# EAGLE design NPKC_alt_PCB (EAGLE 7.4.0)

## Sheet 1 of 2: Switch matrix
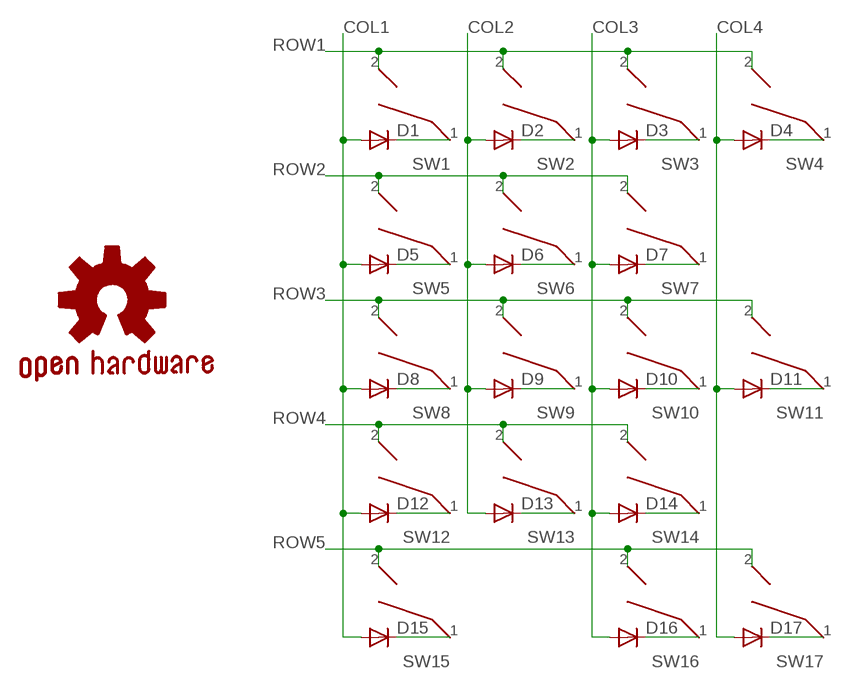
[diagram p0: schematic, sheet 1]

### Parts
D1  CGRM4001-G  [SOD-123_MINI-SMA]
D2  CGRM4001-G  [SOD-123_MINI-SMA]
D3  CGRM4001-G  [SOD-123_MINI-SMA]
D4  CGRM4001-G  [SOD-123_MINI-SMA]
D5  CGRM4001-G  [SOD-123_MINI-SMA]
D6  CGRM4001-G  [SOD-123_MINI-SMA]
D7  CGRM4001-G  [SOD-123_MINI-SMA]
D8  CGRM4001-G  [SOD-123_MINI-SMA]
D9  CGRM4001-G  [SOD-123_MINI-SMA]
D10  CGRM4001-G  [SOD-123_MINI-SMA]
D11  CGRM4001-G  [SOD-123_MINI-SMA]
D12  CGRM4001-G  [SOD-123_MINI-SMA]
D13  CGRM4001-G  [SOD-123_MINI-SMA]
D14  CGRM4001-G  [SOD-123_MINI-SMA]
D15  CGRM4001-G  [SOD-123_MINI-SMA]
D16  CGRM4001-G  [SOD-123_MINI-SMA]
D17  CGRM4001-G  [SOD-123_MINI-SMA]
GOLD_ORB_SM1  OSHWLOGO_GOLD_ORB_SM  [OSHW2]
SW1  Num_Lock  CHERRY_MX_WITH_FIXING_PINS  [MX1A-XXNW]
SW2  NP_/  CHERRY_MX_WITH_FIXING_PINS  [MX1A-XXNW]
SW3  NP_*  CHERRY_MX_WITH_FIXING_PINS  [MX1A-XXNW]
SW4  NP_-  CHERRY_MX_WITH_FIXING_PINS  [MX1A-XXNW]
SW5  NP_7  CHERRY_MX_WITH_FIXING_PINS  [MX1A-XXNW]
SW6  NP_8  CHERRY_MX_WITH_FIXING_PINS  [MX1A-XXNW]
SW7  NP_9  CHERRY_MX_WITH_FIXING_PINS  [MX1A-XXNW]
SW8  NP_4  CHERRY_MX_WITH_FIXING_PINS  [MX1A-XXNW]
SW9  NP_5  CHERRY_MX_WITH_FIXING_PINS  [MX1A-XXNW]
SW10  NP_6  CHERRY_MX_WITH_FIXING_PINS  [MX1A-XXNW]
SW11  NP_+  CHERRY_MX_WITH_FIXING_PINS  [MX1A-XXNW]
SW12  NP_1  CHERRY_MX_WITH_FIXING_PINS  [MX1A-XXNW]
SW13  NP_2  CHERRY_MX_WITH_FIXING_PINS  [MX1A-XXNW]
SW14  NP_3  CHERRY_MX_WITH_FIXING_PINS  [MX1A-XXNW]
SW15  NP_0  CHERRY_MX_WITH_FIXING_PINS  [MX1A-XXNW]
SW16  NP_.  CHERRY_MX_WITH_FIXING_PINS  [MX1A-XXNW]
SW17  NP_Enter  CHERRY_MX_WITH_FIXING_PINS  [MX1A-XXNW]

### Nets
COL1: D1.A D5.A D8.A D12.A D15.A ; also sheet 2
COL2: D2.A D6.A D9.A D13.A ; also sheet 2
COL3: D3.A D7.A D10.A D14.A D16.A ; also sheet 2
COL4: D4.A D11.A D17.A ; also sheet 2
N$1: D1.C SW1.1
N$2: D2.C SW2.1
N$3: D3.C SW3.1
N$4: D4.C SW4.1
N$5: D5.C SW5.1
N$6: D6.C SW6.1
N$7: D7.C SW7.1
N$8: D8.C SW8.1
N$9: D9.C SW9.1
N$10: D10.C SW10.1
N$11: D11.C SW11.1
N$12: D12.C SW12.1
N$13: D13.C SW13.1
N$14: D14.C SW14.1
N$15: D15.C SW15.1
N$16: D16.C SW16.1
N$17: D17.C SW17.1
ROW1: SW1.2 SW2.2 SW3.2 SW4.2 ; also sheet 2
ROW2: SW5.2 SW6.2 SW7.2 ; also sheet 2
ROW3: SW8.2 SW9.2 SW10.2 SW11.2 ; also sheet 2
ROW4: SW12.2 SW13.2 SW14.2 ; also sheet 2
ROW5: SW15.2 SW16.2 SW17.2 ; also sheet 2

## Sheet 2 of 2: Microcontroller
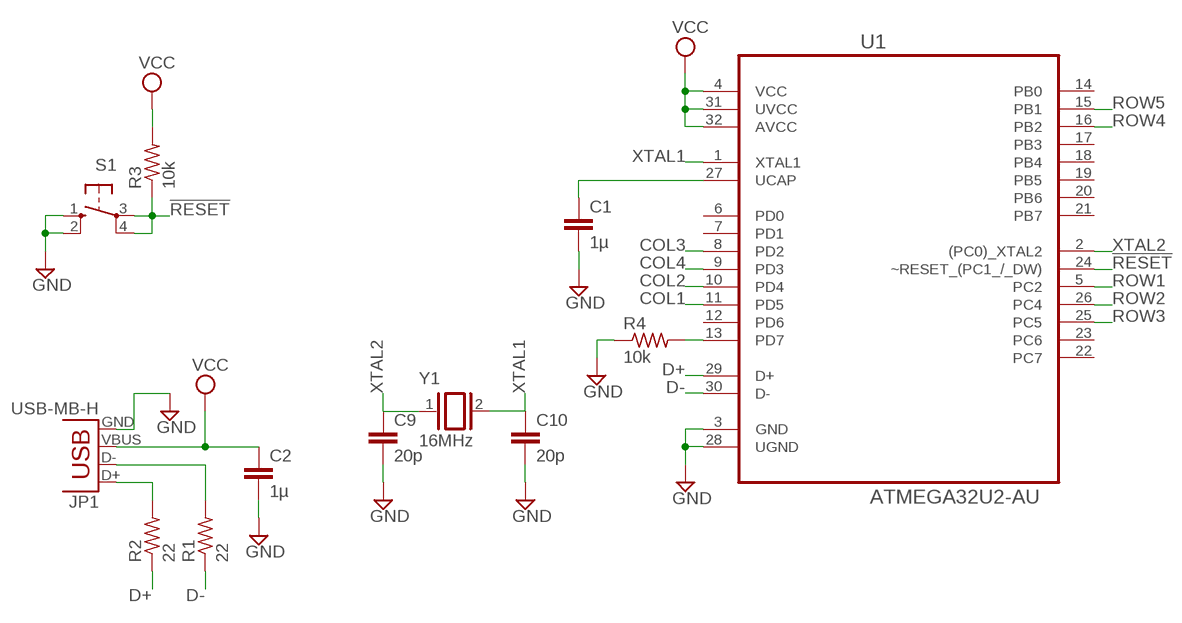
[diagram p1: schematic, sheet 2]

### Parts
C1  1µ  C-EUC0805K  [C0805K]
C2  1µ  C-EUC0805  [C0805]
C9  20p  C-EUC0805K  [C0805K]
C10  20p  C-EUC0805K  [C0805K]
JP1  USB-MB-H  [USB-MB-H]
R1  22  R-US_R0805  [R0805]
R2  22  R-US_R0805  [R0805]
R3  10k  R-US_R0805  [R0805]
R4  10k  R-US_R0805  [R0805]
S1  10-XX  [B3F-10XX]
U1  ATMEGA32U2-AU  [QFP80P900X900X120-32N]
Y1  16MHz  XTAL/S  [QS]

### Nets
!RESET!: R3.1 S1.3(P) S1.4(P1) U1.24(~RESET_(PC1_/_DW))
COL1: U1.11(PD5) ; also sheet 1
COL2: U1.10(PD4) ; also sheet 1
COL3: U1.8(PD2) ; also sheet 1
COL4: U1.9(PD3) ; also sheet 1
D+: R2.1 U1.29(D+)
D-: R1.1 U1.30(D-)
GND: C1.2 C2.2 C9.2 C10.2 JP1.GND R4.1 S1.1(S) S1.2(S1) U1.3(GND) U1.28(UGND)
N$18: C1.1 U1.27(UCAP)
N$19: R4.2 U1.13(PD7)
N$20: JP1.D+ R2.2
N$21: JP1.D- R1.2
ROW1: U1.5(PC2) ; also sheet 1
ROW2: U1.26(PC4) ; also sheet 1
ROW3: U1.25(PC5) ; also sheet 1
ROW4: U1.16(PB2) ; also sheet 1
ROW5: U1.15(PB1) ; also sheet 1
VCC: C2.1 JP1.VBUS R3.2 U1.4(VCC) U1.31(UVCC) U1.32(AVCC)
XTAL1: C10.1 U1.1(XTAL1) Y1.2
XTAL2: C9.1 U1.2((PC0)_XTAL2) Y1.1
Unconnected: U1.6(PD0) U1.7(PD1) U1.12(PD6) U1.14(PB0) U1.17(PB3) U1.18(PB4) U1.19(PB5) U1.20(PB6) U1.21(PB7) U1.22(PC7) U1.23(PC6)

## Library data of the parts
C1 C2 C9 C10 = resistor:C-EU: CAPACITOR, European symbol
D1-D17 = diode:CGRM400*-G: Molded plasitc,JEDEC SOD-123/Mini SMA Source: Comchip CGRM4001-G.pdf
GOLD_ORB_SM1 = OpenHardware:OSHWLOGO: These are Open-Source Hardware logos.
JP1 = SparkFun-Connectors:USB: USB Connectors USB-B-PTH is fully proven SKU : PRT-00139/CONN-08278 USB-miniB is fully proven SKU : PRT-00587 USB-A-PCB is untested. USB-A-H is throughly reviewed, but untested. Spark Fun Electronics SKU : PRT-00437 USB-B-SMT is throughly reviewed, but untested. Needs silkscreen touching up. USB-A-S has not been used/tested USB-MB-H has not been used/tested USB-MICROB has been used. CONN-09505
R1-R4 = resistor:R-US_: RESISTOR, American symbol
S1 = switch-omron:10-XX: OMRON SWITCH; MPN: B3F-1000; OC_FARNELL: 176432; OC_NEWARK: 36M3542
SW1-SW17 = Cherry_MX_v7.0:CHERRY_MX
U1 = ATMEGA32U2:ATMEGA32U2-AU: 8-bit Microcontroller with ISP Flash and USB Controller; MPN: ATMEGA32U2-AU; OC_FARNELL: 1748524; OC_NEWARK: 68T2834; PACKAGE: TQFP-32; SUPPLIER: Atmel
Y1 = special:XTAL/S: CRYSTAL

## Board
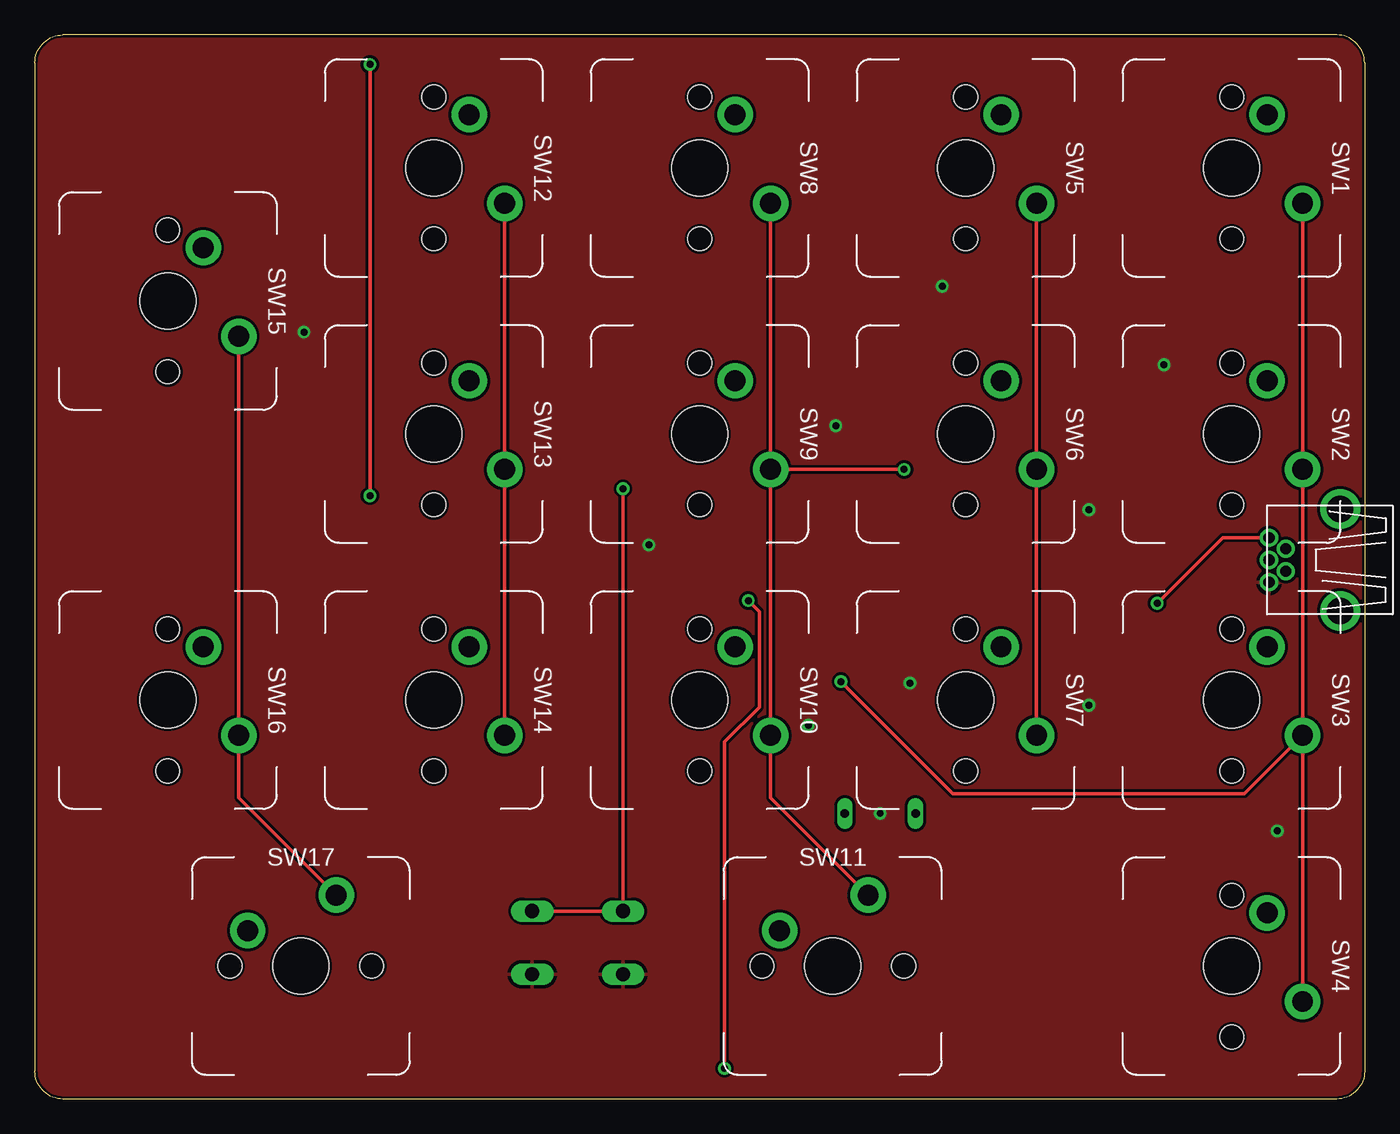
[diagram p2: board, top side]
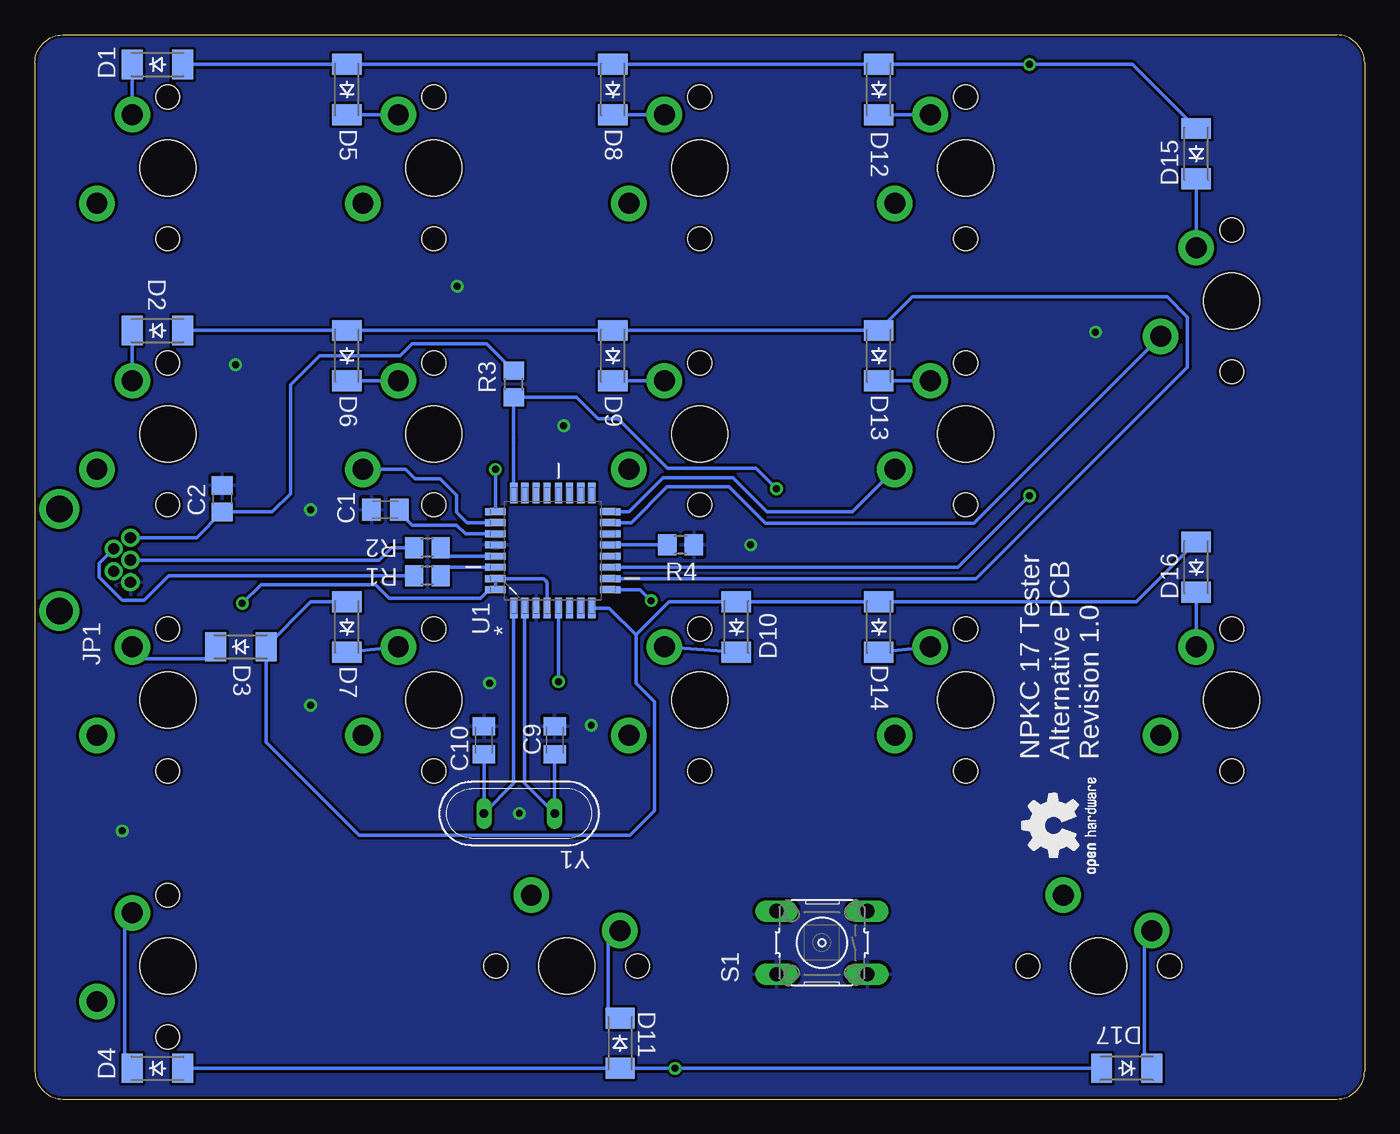
[diagram p3: board, bottom side, seen from below]

Size 95.25 x 76.2 mm. Coordinates in mm from the lower left corner, seen from the top.
Outline: 0,74.2 0,2 arc90 2,0 93.25,0 arc90 95.25,2 95.25,74.2 arc90 93.25,76.2 2,76.2 arc90 0,74.2
Copper layers (1*16): Top 0.035mm / dielectric 1.5mm / Bottom 0.035mm
Design rules "default *": minimum track width 10mil, minimum drill 24mil, track to track 8mil, track to pad 8mil, pad to pad 8mil, via to via 8mil, smd to smd 8mil, copper to edge 8mil, drill to drill 8mil, minimum pad ring 10mil, minimum via ring 8mil, stop-mask expansion 4mil, vias tented up to drill 0mil, thermal gap 10mil

### Footprints (pad centres in the part's own frame; a part is rotated, then mirrored left to right if it is on the bottom)
C0805K = smd 1.3 x 1.6: 1 -1,0; 2 1,0
C0805 = smd 1.3 x 1.5: 1 -0.95,0; 2 0.95,0
SOD-123_MINI-SMA = smd 1.5 x 2.1: A 1.8,0; C -1.8,0
USB-MB-H = drill 0.8: D+ 5.1,0; D- 3.9,0.8; GND 5.1,-1.6; ID 3.9,-0.8; VBUS 5.1,1.6 | drill 1.9: P$6 0,-3.65; P$7 0,3.65
R0805 = smd 1.3 x 1.5: 1 -0.95,0; 2 0.95,0
B3F-10XX = drill 1.016 long: 1 -3.251,2.261; 2 3.251,2.261; 3 -3.251,-2.261; 4 3.251,-2.261
MX1A-XXNW = drill 1.5 pad 2.54: 1 -3.81,2.54; 2 2.54,5.08 | hole 4: 0,0 | hole 1.7: -5.08,0; 5.08,0
QFP80P900X900X120-32N = smd 1.473 x 0.508: 1 -4.115,2.794; 2 -4.115,2.007; 3 -4.115,1.194; 4 -4.115,0.406; 5 -4.115,-0.406; 6 -4.115,-1.194; 7 -4.115,-2.007; 8 -4.115,-2.794; 17 4.115,-2.794; 18 4.115,-2.007; 19 4.115,-1.194; 20 4.115,-0.406; 21 4.115,0.406; 22 4.115,1.194; 23 4.115,2.007; 24 4.115,2.794 | smd 0.508 x 1.473: 9 -2.794,-4.115; 10 -2.007,-4.115; 11 -1.194,-4.115; 12 -0.406,-4.115; 13 0.406,-4.115; 14 1.194,-4.115; 15 2.007,-4.115; 16 2.794,-4.115; 25 2.794,4.115; 26 2.007,4.115; 27 1.194,4.115; 28 0.406,4.115; 29 -0.406,4.115; 30 -1.194,4.115; 31 -2.007,4.115; 32 -2.794,4.115
QS = drill 0.61 long: 1 -2.54,0; 2 2.54,0

### Placement (x,y rotation side)
C1  70.14,42.2 180 bottom
C2  81.82,42.99 90 bottom
C9  58.01,25.7 90 bottom
C10  63.09,25.7 90 bottom
D1  86.47,74.08 0 bottom
D2  86.47,55.03 0 bottom
D3  80.5,32.38 0 bottom
D4  86.47,2.2 0 bottom
D5  72.9,72.28 90 bottom
D6  72.9,53.23 90 bottom
D7  72.9,33.8 90 bottom
D8  53.85,72.28 90 bottom
D9  53.85,53.23 90 bottom
D10  45,33.8 90 bottom
D11  53.34,4 270 bottom
D12  34.8,72.28 90 bottom
D13  34.8,53.23 90 bottom
D14  34.8,33.8 90 bottom
D15  12.06,67.7 90 bottom
D16  12.06,38.09 90 bottom
D17  17.04,2.2 180 bottom
GOLD_ORB_SM1  18,15.77 90 bottom
JP1  93.5,38.6 0 bottom
R1  67.14,37.47 180 bottom
R2  67.14,39.48 180 bottom
R3  60.95,51.2 90 bottom
R4  49,39.68 180 bottom
S1  38.88,11.2 180 bottom
SW1  85.72,66.67 270 top
SW2  85.72,47.62 270 top
SW3  85.72,28.57 270 top
SW4  85.72,9.53 270 top
SW5  66.67,66.67 270 top
SW6  66.67,47.62 270 top
SW7  66.67,28.57 270 top
SW8  47.62,66.67 270 top
SW9  47.62,47.62 270 top
SW10  47.62,28.57 270 top
SW11  57.15,9.53 0 top
SW12  28.57,66.67 270 top
SW13  28.57,47.62 270 top
SW14  28.57,28.57 270 top
SW15  9.53,57.15 270 top
SW16  9.53,28.57 270 top
SW17  19.05,9.53 0 top
U1  58.15,39.27 90 bottom
Y1  60.55,20.45 180 bottom

### Tracks (layer width: path | path; a pad name or v marks a point on that pad's centre or on a via)
!RESET!  (via drill 0.5)
  Top 0.254: S1.3 S1.4 v42.13,43.7
  Bottom 0.254: U1.24 60.94,47.2 R3.1 56.45,50.25 54.9,48.7 53.47,48.7 49.92,45.16 43.59,45.16 v42.13,43.7
COL1  (via drill 0.5)
  Top 0.254: v24,43.2 v24,74.08
  Bottom 0.254: D15.A 16.65,74.08 v24,74.08 D12.A D8.A D5.A D1.A | v24,43.2 29.12,38.08 U1.11
COL2
  Bottom 0.254: D2.A D6.A D9.A D13.A 32.38,57.45 14.14,57.45 12.7,56 12.7,52.41 27.84,37.27 U1.10
COL3
  Bottom 0.254: D7.A 75.48,35.6 D3.A 78.7,25.56 72.04,18.9 52.62,18.9 50.85,20.66 50.85,28.43 52.2,29.79 52.2,33.23 | D16.A 16.36,35.6 D14.A D10.A 49.84,35.6 52.2,33.23 | 52.2,33.23 54.13,35.16 U1.8
COL4  (via drill 0.5)
  Top 0.254: v49.4,2.2 49.4,25.57 51.9,28.07 51.9,34.9 v51.1,35.69
  Bottom 0.254: v51.1,35.69 51.9,36.48 U1.9 | D4.A D11.A v49.4,2.2 D17.A
D+
  Bottom 0.254: U1.29 65.58,38.87 R2.1
D-
  Bottom 0.254: U1.30 65.58,38.08 R1.1
GND  (via drill 0.5)
  other vias: 65,58.2 89,19.2 75.5,42.2 75.5,28.2 55.4,26.77 43.98,39.68 80.88,52.59 62.67,29.79 19.28,54.92 57.37,48.21 60.55,20.45
  pour Bottom: 0,76.2 0,0 95.25,0 95.25,76.2
  pour Top: 0,76.2 0,0 95.25,0 95.25,76.2
N$1
  Bottom 0.254: SW1.1 D1.C
N$2
  Bottom 0.254: SW2.1 D2.C
N$3
  Bottom 0.254: SW3.1 87.42,31.54 83.08,31.54 82.3,32.32 D3.C
N$4
  Bottom 0.254: SW4.1 88.81,12.79 88.81,3.29 88.27,2.73 D4.C
N$5
  Bottom 0.254: SW5.1 D5.C
N$6
  Bottom 0.254: SW6.1 D6.C
N$7
  Bottom 0.254: SW7.1 D7.C
N$8
  Bottom 0.254: SW8.1 D8.C
N$9
  Bottom 0.254: SW9.1 D9.C
N$10
  Bottom 0.254: SW10.1 D10.C
N$11
  Bottom 0.254: SW11.1 54.19,11.21 54.19,6.57 53.42,5.8 D11.C
N$12
  Bottom 0.254: SW12.1 D12.C
N$13
  Bottom 0.254: SW13.1 D13.C
N$14
  Bottom 0.254: SW14.1 D14.C
N$15
  Bottom 0.254: SW15.1 D15.C
N$16
  Bottom 0.254: SW16.1 D16.C
N$17
  Bottom 0.254: SW17.1 15.79,11.51 15.79,3.31 15.24,2.75 D17.C
N$18
  Bottom 0.254: U1.27 64.41,40.47 65.04,41.09 68.25,41.09 69.14,41.99 C1.1
N$19
  Bottom 0.254: R4.2 U1.13
N$20
  Bottom 0.254: JP1.D+ 70.6,38.6 69.72,39.48 R2.2
N$21
  Bottom 0.254: JP1.D- 90.64,38.36 90.64,37.37 89,35.73 87.41,35.73 85.67,37.47 R1.2
ROW1  (via drill 0.5)
  Top 0.254: SW1.2 SW2.2 SW3.2 | SW3.2 SW4.2 | SW3.2 86.64,21.86 65.77,21.86 v57.74,29.89
  Bottom 0.254: v57.74,29.89 U1.5
ROW2
  Top 0.254: SW5.2 SW6.2 SW7.2
  Bottom 0.254: SW6.2 68.69,45.09 68.01,44.41 66.21,44.41 65.03,43.23 65.03,42.03 64.29,41.28 U1.26
ROW3  (via drill 0.5)
  Top 0.254: SW8.2 SW9.2 | SW9.2 SW10.2 52.7,21.59 SW11.2 | SW9.2 v62.27,45.09
  Bottom 0.254: v62.27,45.09 U1.25
ROW4
  Top 0.254: SW12.2 SW13.2 SW14.2
  Bottom 0.254: SW13.2 36.67,42.07 42.8,42.07 45.24,44.51 50.24,44.51 52.68,42.07 U1.16
ROW5
  Top 0.254: SW15.2 SW16.2 14.61,21.59 SW17.2
  Bottom 0.254: SW15.2 27.98,41.23 42.91,41.23 45.52,43.85 49.96,43.85 52.53,41.28 U1.15
VCC  (via drill 0.5)
  Top 0.254: JP1.VBUS 85.09,40.2 v80.39,35.5
  Bottom 0.254: U1.4 58.56,36.86 arc-90 58.96,37.27 U1.31 U1.32 62.71,36.48 63.31,35.88 69.87,35.88 70.83,36.84 79.06,36.84 v80.39,35.5 | R3.2 62.88,54.09 68.23,54.09 69.08,53.23 74.86,53.23 76.94,51.16 76.94,43.36 78.25,42.04 C2.1 83.66,40.2 JP1.VBUS
XTAL1
  Bottom 0.254: U1.1 60.94,22.6 Y1.2 C10.1
XTAL2
  Bottom 0.254: U1.2 60.16,22.6 Y1.1 C9.1

### Text on the board
bPlace: NPKC 17 Tester / Alternative PCB / Revision 1.0
tTest: Except for the switches, / all components *must* be / soldered at the bottom / side of the PCB, mini USB / connector included.